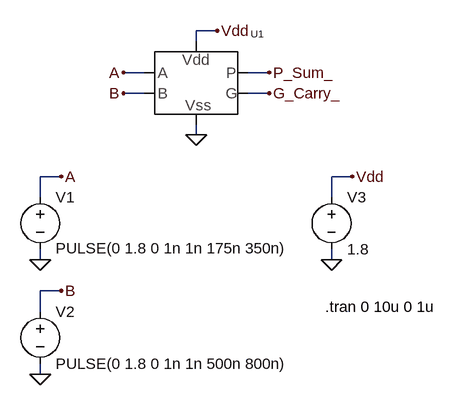
[diagram p0: schematic PG_Generator.asc]
PG_Generator.asc, the LTspice schematic file:
Version 4
SHEET 1 880 680
WIRE 272 16 240 16
WIRE 240 32 240 16
WIRE 160 80 128 80
WIRE 352 80 320 80
WIRE 160 112 128 112
WIRE 352 112 320 112
WIRE 240 176 240 160
WIRE 32 240 0 240
WIRE 480 240 448 240
WIRE 0 272 0 240
WIRE 448 272 448 240
WIRE 0 368 0 352
WIRE 448 368 448 352
WIRE 32 416 0 416
WIRE 0 448 0 416
WIRE 0 544 0 528
FLAG 240 176 0
FLAG 272 16 Vdd
FLAG 32 240 A
FLAG 32 416 B
FLAG 0 368 0
FLAG 0 544 0
FLAG 128 80 A
FLAG 128 112 B
FLAG 448 368 0
FLAG 480 240 Vdd
FLAG 352 80 P_Sum_
FLAG 352 112 G_Carry_
SYMBOL PG_Generator 240 96 R0
SYMATTR InstName U1
SYMBOL voltage 0 256 R0
WINDOW 3 24 94 Left 2
WINDOW 123 0 0 Left 0
WINDOW 39 0 0 Left 0
SYMATTR InstName V1
SYMATTR Value PULSE(0 1.8 0 1n 1n 175n 350n)
SYMBOL voltage 0 432 R0
WINDOW 123 0 0 Left 0
WINDOW 39 0 0 Left 0
SYMATTR InstName V2
SYMATTR Value PULSE(0 1.8 0 1n 1n 500n 800n)
SYMBOL voltage 448 256 R0
WINDOW 123 0 0 Left 0
WINDOW 39 0 0 Left 0
SYMATTR InstName V3
SYMATTR Value 1.8
TEXT 438 440 Left 2 !.tran 0 10u 0 1u

The netlist it stands for:
* PG_Generator.asc
XU1 A B P_Sum_ G_Carry_ Vdd 0 PG_Generator  ; pins A B P G Vdd Vss
V1 A 0 PULSE(0 1.8 0 1n 1n 175n 350n)
V2 B 0 PULSE(0 1.8 0 1n 1n 500n 800n)
V3 Vdd 0 1.8
.tran 0 10u 0 1u
.lib PG_Generator.sub
.backanno
.end